# Altium schematic sheet GP8403-TC50-EW_C31520071_GP8403-TC50-EW_C3152007.schdoc
size 124 x 101 mm
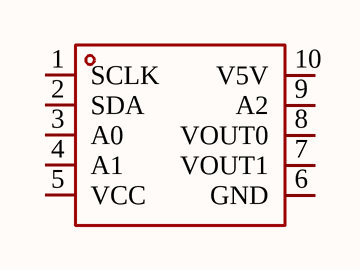
[diagram p0: GP8403-TC50-EW_C31520071_GP8403-TC50-EW_C3152007.schdoc]

## Parts
U?  GP8403-TC50-EW  [ESSOP-10_L4.9-W3.9-P1.00-LS6.0-BL-EP]  (value not drawn)

## Nets

Not connected (* = marked no-connect by the designer): U? 1(SCLK) 2(SDA) 3(A0) 4(A1) 5(VCC) 6(GND) 7(VOUT1) 8(VOUT0) 9(A2) 10(V5V)

## Library data of the parts
U? = GP8403-TC50-EW: Manufacturer: Guestgood(客益); Symbol: GP8403-TC50-EW_C3152007; Add into BOM: yes; Device: GP8403-TC50-EW; LCSC Part Name: 双路0-10V (0.1%); Supplier Part: C3152007; Manufacturer Part: GP8403-TC50-EW; Supplier Footprint: ESSOP-10-150mil; JLCPCB Part Class: Extended Part; Datasheet: https://atta.szlcsc.com/upload/public/pdf/source/20230324/119C3D24177D38ACF0484191557FF3D8.pdf; Supplier: LCSC; Convert to PCB: yes